# Altium schematic sheet Front-End-Power-Protection.SchDoc
size A4; SheetNumber: 1; SheetTotal: 1
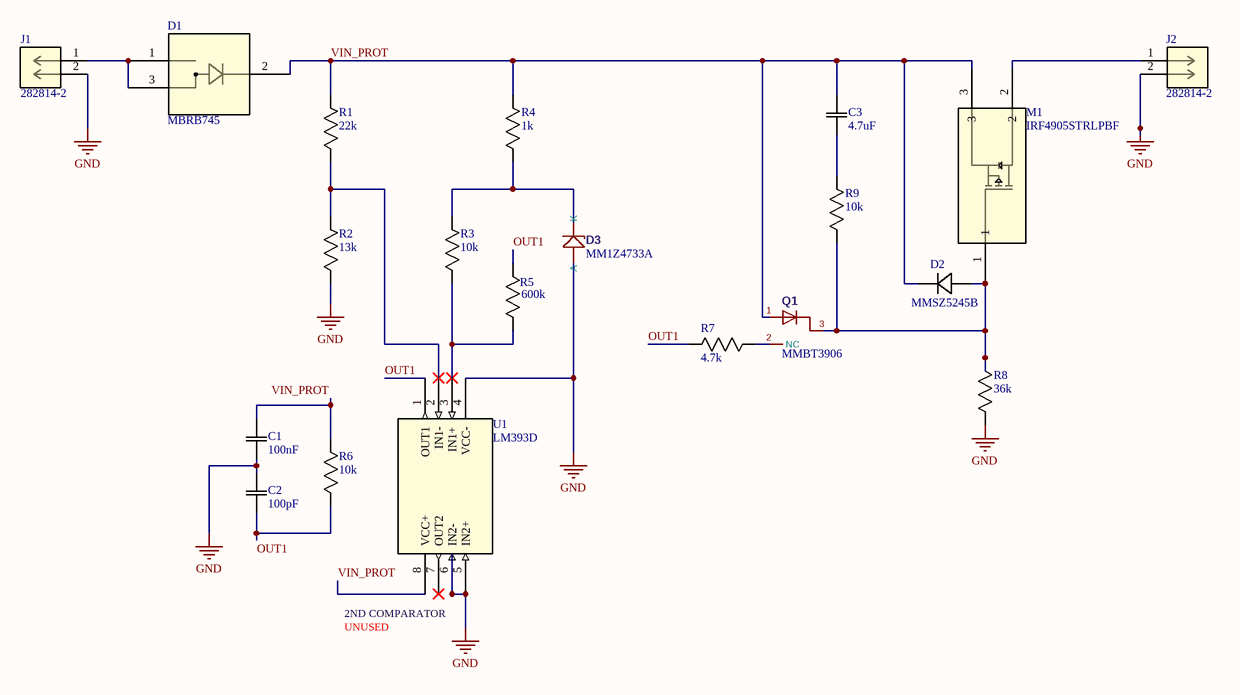
[diagram p0: Front-End-Power-Protection.SchDoc]

## Parts
C1  100nF  [CAP_X7R_0805_AVX]
C2  100pF  [CAP_X7R_0805_AVX]
C3  4.7uF  [CAP_CC1210_YAG]
D1  MBRB745  [D2PAK_VIS]
D2  MMSZ5245B  [SOD123_DIO]
D3  MM1Z4733A  [SOD-123FL]
J1  282814-2  [CONN2_282814-2]
J2  282814-2  [CONN2_282814-2]
M1  IRF4905STRLPBF  [TRAN_IRF4905STRLPBF_INF]
Q1  MMBT3906  [SOT-23]
R1  22k  [RC0805N_YAG]
R2  13k  [RC0805N_YAG]
R3  10k  [RC0805N_YAG]
R4  1k  [RC0805N_YAG]
R5  600k  [RC0805N_YAG]
R6  10k  [RC0805N_YAG]
R7  4.7k  [RC0805N_YAG]
R8  36k  [RC0805N_YAG]
R9  10k  [RC0805N_YAG]
U1  LM393D  [SO8_STM]

## Nets
GND: C1.1 C2.2 D3.A J1.2 J2.2 R2.2 R8.2 U1.4(VCC-) U1.5(IN2+) U1.6(IN2-)
OUT1: C2.1 R5.1 R6.2 R7.1 U1.1(OUT1)
VIN_PROT: C1.2 C3.2 D1.2 D2.1 M1.3 Q1.1(A) R1.1 R4.1 R6.1 U1.8(VCC+)
NetC3_1: C3.1 R9.1
NetD1_1: D1.1 D1.3 J1.1
NetD2_2: D2.2 M1.1 Q1.3(K) R8.1 R9.2
NetD3_K: D3.K R3.2 R4.2
NetJ2_1: J2.1 M1.2
NetQ1_2: Q1.2(NC) R7.2
NetR1_2: R1.2 R2.1 U1.2(IN1-)
NetR3_1: R3.1 R5.2 U1.3(IN1+)

Not connected (* = marked no-connect by the designer): U1 7(OUT2)*

## Notes on the sheet
- 2ND COMPARATOR
- UNUSED

## Library data of the parts
C1 C2 = 08053C104KAT2A: Manufacturer_Name: KYOCERA AVX; Copyright: Copyright (C) 2026 Ultra Librarian. All rights reserved.; Manufacturer_Part_Number: 08053C104KAT2A
C3 = CC1210KKX7R9BB475: Manufacturer_Name: Yageo; Copyright: Copyright (C) 2026 Ultra Librarian. All rights reserved.; Manufacturer_Part_Number: CC1210KKX7R9BB475
D1 = MBRB745: No Description Available; Manufacturer_Name: Vishay; Copyright: Copyright (C) 2026 Ultra Librarian. All rights reserved.; Manufacturer_Part_Number: MBRB745
D2 = MMSZ5245B-7-F: Manufacturer_Name: Diodes Inc; Copyright: Copyright (C) 2026 Ultra Librarian. All rights reserved.; Manufacturer_Part_Number: MMSZ5245B-7-F
D3 = MM1Z4733A: ki_keywords: CLD current limiting diode; Value: CLD-Diode; Reference: D; Datasheet: https://diotec.com/de/produktliste/C.html; ki_description: CLD Current Limiting Diode
J1 J2 = 282814-2: TERMI-BLOK HEADER,ASSY90 2P.5; Manufacturer_Name: TE Connectivity; Copyright: Copyright (C) 2026 Ultra Librarian. All rights reserved.; Manufacturer_Part_Number: 282814-2; Datasheet: https://www.te.com/commerce/DocumentDelivery/DDEController?Action=srchrtrv&DocNm=1-1773458-1_EURO_STYLE_QRG&DocType=Data+Sheet&DocLang=English&PartCntxt=282814-2&DocFormat=pdf; RefDes: RefDes; Type: Type
M1 = IRF4905STRLPBF: No Description Available; Manufacturer_Name: Infineon; Copyright: Copyright (C) 2026 Ultra Librarian. All rights reserved.; Manufacturer_Part_Number: IRF4905STRLPBF; Datasheet: https://www.infineon.com/dgdl/irf4905spbf.pdf?fileId=5546d462533600a4015355e331c41980; RefDes: RefDes; Type: Type
Q1 = MMBT3906: ki_keywords: Doide NC pin; ki_description: Diode with NC pin; Value: Diode; Reference: D; Datasheet: https://diotec.com/de/produktliste/D.html
R1-R9 = RC0805FR-0722KL: Manufacturer_Name: Yageo; Copyright: Copyright (C) 2026 Ultra Librarian. All rights reserved.; Manufacturer_Part_Number: RC0805FR-0722KL; Digi-Key_Part_Number_1: 311-22.0KCRCT-ND; Digi-Key_Part_Number_2: 311-22.0KCRDKR-ND; Digi-Key_Part_Number_3: 311-22.0KCRTR-ND; Digi-Key_Part_Number_4: 311-22.0KCRTR-NDL
U1 = LM393D: Low power dual voltage comparator; Manufacturer_Name: STMicroelectronics; Copyright: Copyright (C) 2025 Ultra Librarian. All rights reserved.; Manufacturer_Part_Number: LM393D; RefDes: RefDes; Type: Type